# EAGLE design zero_board (EAGLE 9.6.2)
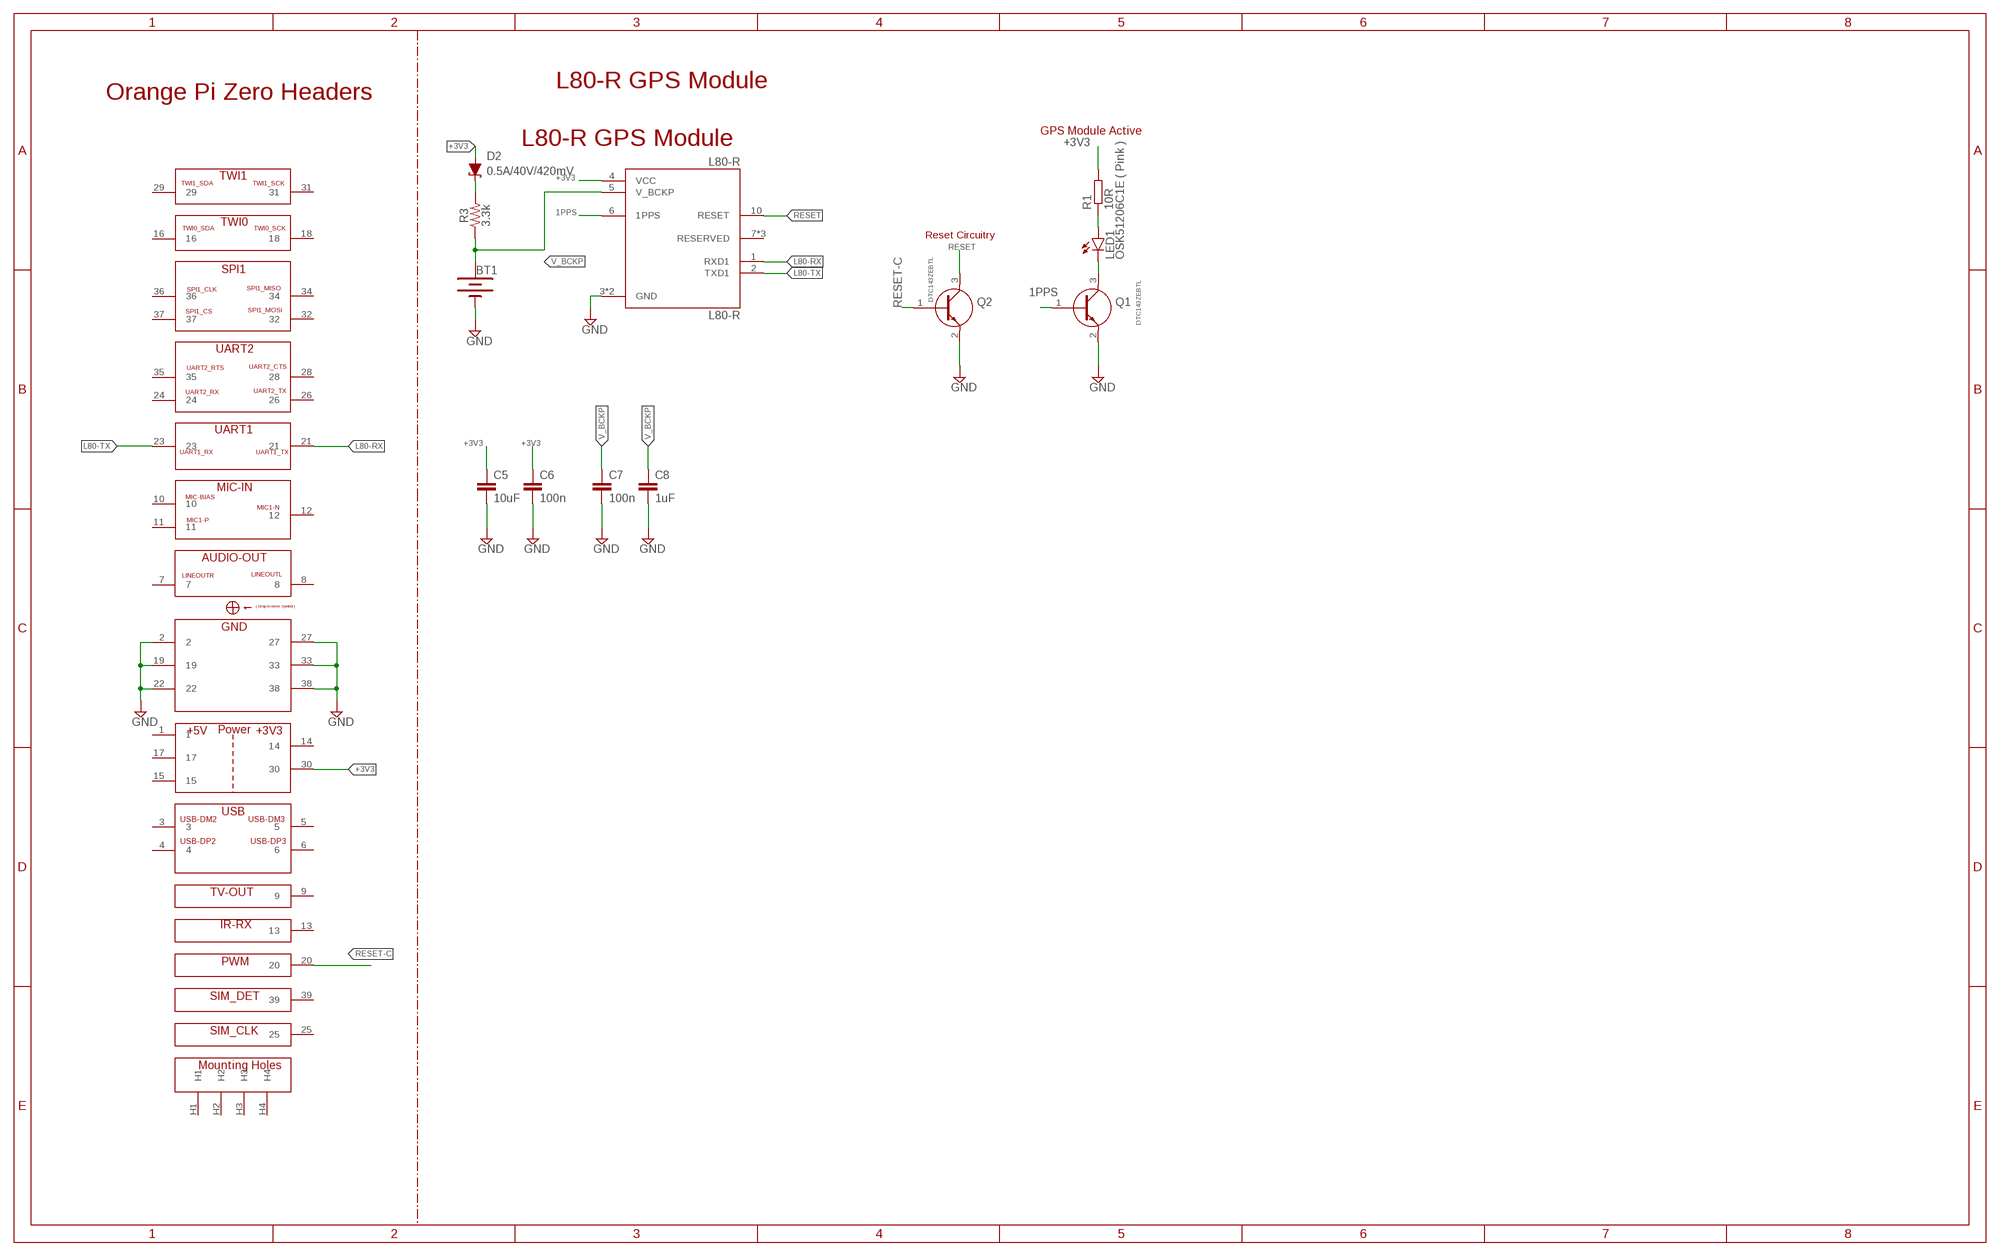
[diagram p0: schematic, sheet 1]

## Parts
BT1  6.8MM_COIN_CELL  ML414H_IV01E_BATTERY  [ML414H_IV01E]
C5  10uF  C-EUC0603  [C0603]
C6  100n  C-EUC0603  [C0603]
C7  100n  C-EUC0603  [C0603]
C8  1uF  C-EUC0603  [C0603]
D2  0.5A/40V/420mV  DIODE-SCHOTTKY-PMEG4005EJ  [SOD-323]
L80-R  L80-R  [XCVR_L80-R]
LED1  OSK51206C1E ( Pink )  LEDCHIPLED_1206  [CHIPLED_1206]
Q1  DTC143ZEBTL  [SOTFL50P160X85-3N]
Q2  DTC143ZEBTL  [SOTFL50P160X85-3N]
R1  10R  R-EU_R1206  [R1206]
R3  3.3k  3.3KOHM-0603-1/10W-1%  [0603]
U$1  ORANGE-PI-ZERO-ADDON  [ORANGE-PI-ZERO-ADDON]

## Nets
1PPS: L80-R.6(1PPS) Q1.1(B)
+3V3: C5.1 C6.1 D2.A L80-R.4(VCC) R1.2 U$1.30
GND: BT1.- C5.2 C6.2 C7.2 C8.2 L80-R.3(GND) L80-R.12(GND) Q1.2(E) Q2.2(E) U$1.2 U$1.19 U$1.22 U$1.27 U$1.33 U$1.38
L80-RX: L80-R.1(RXD1) U$1.21
L80-TX: L80-R.2(TXD1) U$1.23
N$3: LED1.C Q1.3(C)
N$4: LED1.A R1.1
N$6: D2.C R3.2
RESET: L80-R.10(RESET) Q2.3(C)
RESET-C: Q2.1(B) U$1.20
V_BCKP: BT1.+ C7.1 C8.1 L80-R.5(V_BCKP) R3.1
Unconnected: L80-R.7(RESERVED) L80-R.8(RESERVED) L80-R.11(RESERVED) U$1.3 U$1.4 U$1.5 U$1.6 U$1.7 U$1.8 U$1.9 U$1.10 U$1.11 U$1.12 U$1.13 U$1.16 U$1.18 U$1.24 U$1.25 U$1.26 U$1.28 U$1.29 U$1.31 U$1.32 U$1.34 U$1.35 U$1.36 U$1.37 U$1.39 U$1.H1 U$1.H2 U$1.H3 U$1.H4

## Notes on the sheet
- L80-R GPS Module
- Orange Pi Zero Headers
- GPS Module Active
- L80-R GPS Module
- Reset Circuitry

## Power pins joined to a net without a drawn wire
1: U$1.1
14: U$1.14
15: U$1.15
17: U$1.17

## Library data of the parts
BT1 = SparkFun-Batteries:ML414H_IV01E_BATTERY: SEIKO ML414H-IV01E Reflowable Lithium Battery ML414H is a rechargeable, coin type battery with features such as Pb-free reflowable (Peak temperature: 260 C) and high temperature heat resistance. Battery Characteristics: 3.1V max voltage Voff is 2V 1mAH 3k series resistor with battery 72 hour charge time from 2.0-3.1V 2.3-2.8V initial charge; PROD_ID: BATT-14267
C5-C8 = rcl:C-EU: CAPACITOR, European symbol; SPICEPREFIX: C
D2 = SparkFun-DiscreteSemi:DIODE-SCHOTTKY: Schottky diode A Schottky diode is a semiconductor diode which has a low forward voltage drop and a very fast switching action.; PROD_ID: DIO-10955
L80-R = L80-R:L80-R; AVAILABILITY: Unavailable; DESCRIPTION: L80-R is an ultra compact GPS POT (Patch on Top) module with an embedded 15.0mm × 15.0mm × 4.0mm patch antenna; MF: Quectel; MP: L80-R; PACKAGE: None; PRICE: None
LED1 = led:LED: LED OSRAM: - CHIPLED LG R971, LG N971, LY N971, LG Q971, LY Q971, LO R971, LY R971 LH N974, LH R974 LS Q976, LO Q976, LY Q976 LO Q996 - Hyper CHIPLED LW Q18S LB Q993, LB Q99A, LB R99A - SideLED LS A670, LO A670, LY A670, LG A670, LP A670 LB A673, LV A673, LT A673, LW A673 LH A674 LY A675 LS A676, LA A676, LO A676, LY A676, LW A676 LS A679, LY A679, LG A679 - Hyper Micro SIDELED® LS Y876, LA Y876, LO Y876, LY Y876 LT Y87S - SmartLED LW L88C, LW L88S LB L89C, LB L89S, LG L890 LS L89K, LO L89K, LY L89K LS L896, LA L896, LO L896, LY L896 - TOPLED LS T670, LO T670, LY T670, LG T670, LP T670 LSG T670, LSP T670, LSY T670, LOP T670, LYG T670 LG T671, LOG T671, LSG T671 LB T673, LV T673, LT T673, LW T673 LH T674 LS T676, LA T676, LO T676, LY T676, LB T676, LH T676, LSB T676, LW T676 LB T67C, LV T67C, LT T67C, LS T67K, LO T67K, LY T67K, LW E67C LS E67B, LA E67B, LO E67B, LY E67B, LB E67C, LV E67C, LT E67C LW T67C LS T679, LY T679, LG T679 LS T770, LO T770, LY T770, LG T770, LP T770 LB T773, LV T773, LT T773, LW T773 LH T774 LS E675, LA E675, LY E675, LS T675 LS T776, LA T776, LO T776, LY T776, LB T776 LHGB T686 LT T68C, LB T68C - Hyper Mini TOPLED® LB M676 - Mini TOPLED Santana® LG M470 LS M47K, LO M47K, LY M47K Source: http://www.osram.convergy.de LUXEON: - LUMILED® LXK2-PW12-R00, LXK2-PW12-S00, LXK2-PW14-U00, LXK2-PW14-V00 LXK2-PM12-R00, LXK2-PM12-S00, LXK2-PM14-U00 LXK2-PE12-Q00, LXK2-PE12-R00, LXK2-PE12-S00, LXK2-PE14-T00, LXK2-PE14-U00 LXK2-PB12-K00, LXK2-PB12-L00, LXK2-PB12-M00, LXK2-PB14-N00, LXK2-PB14-P00, LXK2-PB14-Q00 LXK2-PR12-L00, LXK2-PR12-M00, LXK2-PR14-Q00, LXK2-PR14-R00 LXK2-PD12-Q00, LXK2-PD12-R00, LXK2-PD12-S00 LXK2-PH12-R00, LXK2-PH12-S00 LXK2-PL12-P00, LXK2-PL12-Q00, LXK2-PL12-R00 Source: www.luxeon.com KINGBRIGHT: KA-3528ASYC Source: www.kingbright.com
Q1 Q2 = SamacSys_Parts:DTC143ZEBTL: ROHM, DTC143ZEBTL NPN Digital Transistor, 100 mA 50 V 4.7 k, Ratio Of 10, 3-Pin SC-89 Source: Datasheet <https://www.rohm.com/datasheet/DTC143ZEB/dtc143zebtl-e>; ARROW_PART_NUMBER: DTC143ZEBTL; ARROW_PRICE-STOCK: https://www.arrow.com/en/products/dtc143zebtl/rohm-semiconductor; DESCRIPTION: ROHM, DTC143ZEBTL NPN Digital Transistor, 100 mA 50 V 4.7 k, Ratio Of 10, 3-Pin SC-89; HEIGHT: 0.85mm; MANUFACTURER_NAME: ROHM Semiconductor; MANUFACTURER_PART_NUMBER: DTC143ZEBTL; MOUSER_PART_NUMBER: 755-DTC143ZEBTL; MOUSER_PRICE-STOCK: https://www.mouser.co.uk/ProductDetail/ROHM-Semiconductor/DTC143ZEBTL?qs=IsRgwgmxh6%252Bn%252Bp0edl8N%2Fw%3D%3D
R1 = rcl:R-EU_: RESISTOR, European symbol; SPICEPREFIX: R
R3 = SparkFun-Resistors:3.3KOHM: 3.3kΩ resistor A resistor is a passive two-terminal electrical component that implements electrical resistance as a circuit element. Resistors act to reduce current flow, and, at the same time, act to lower voltage levels within circuits. - Wikipedia; PROD_ID: RES-07851
U$1 = Orange-Pi-Zero-Addon-Board:ORANGE-PI-ZERO-ADDON

## Board
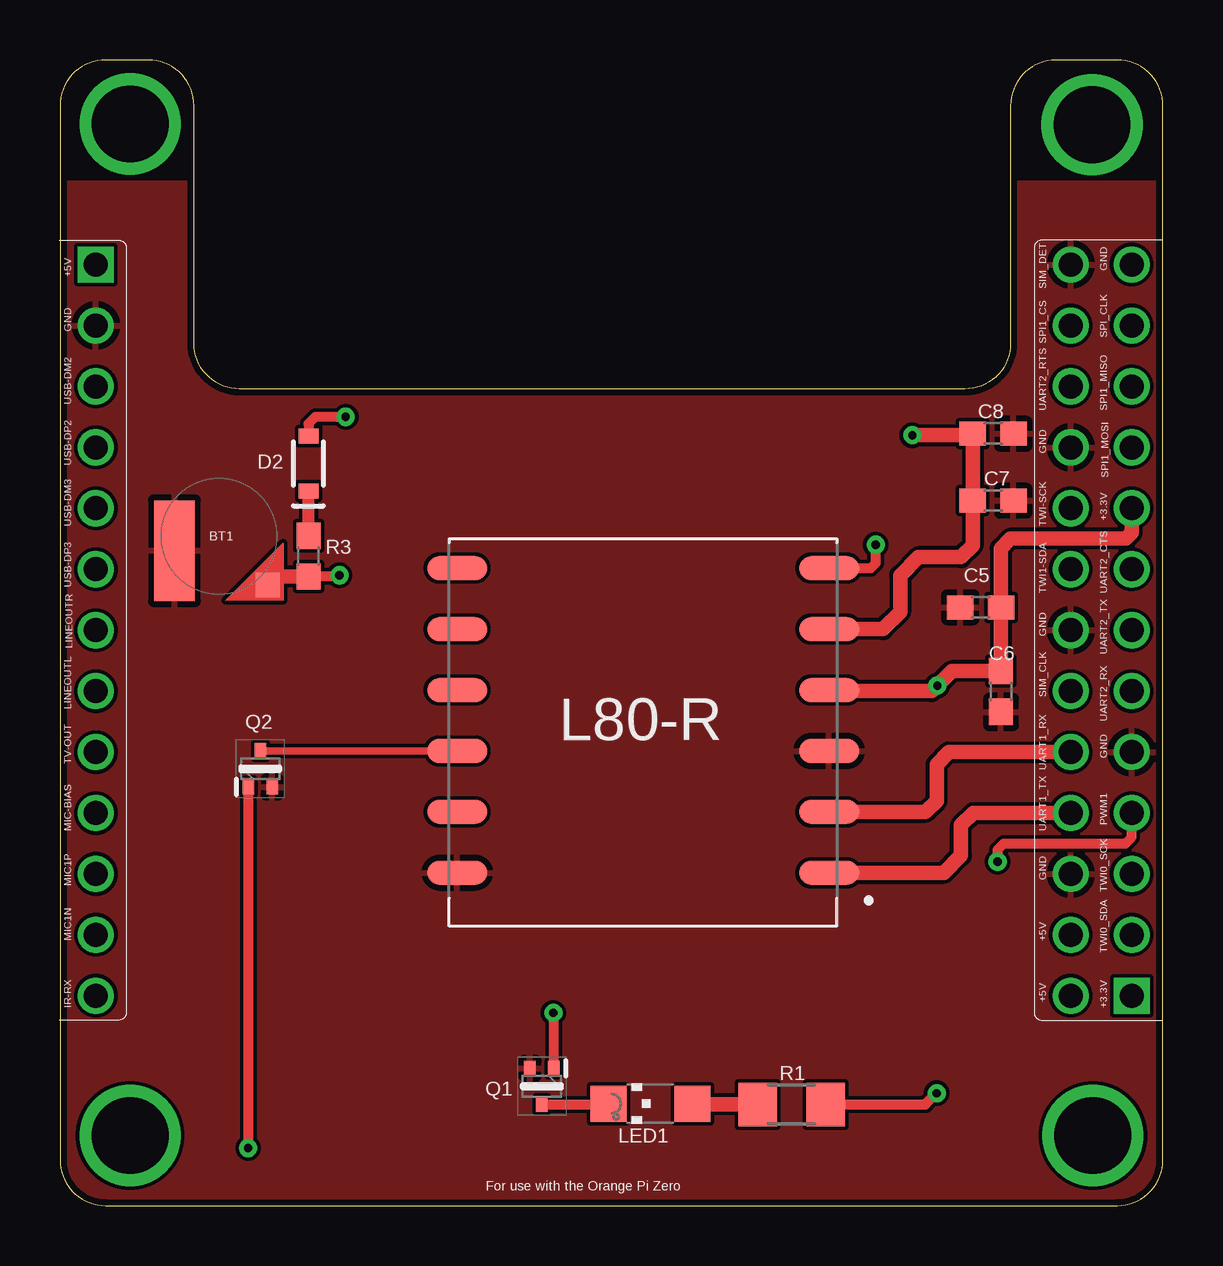
[diagram p1: board, top side]
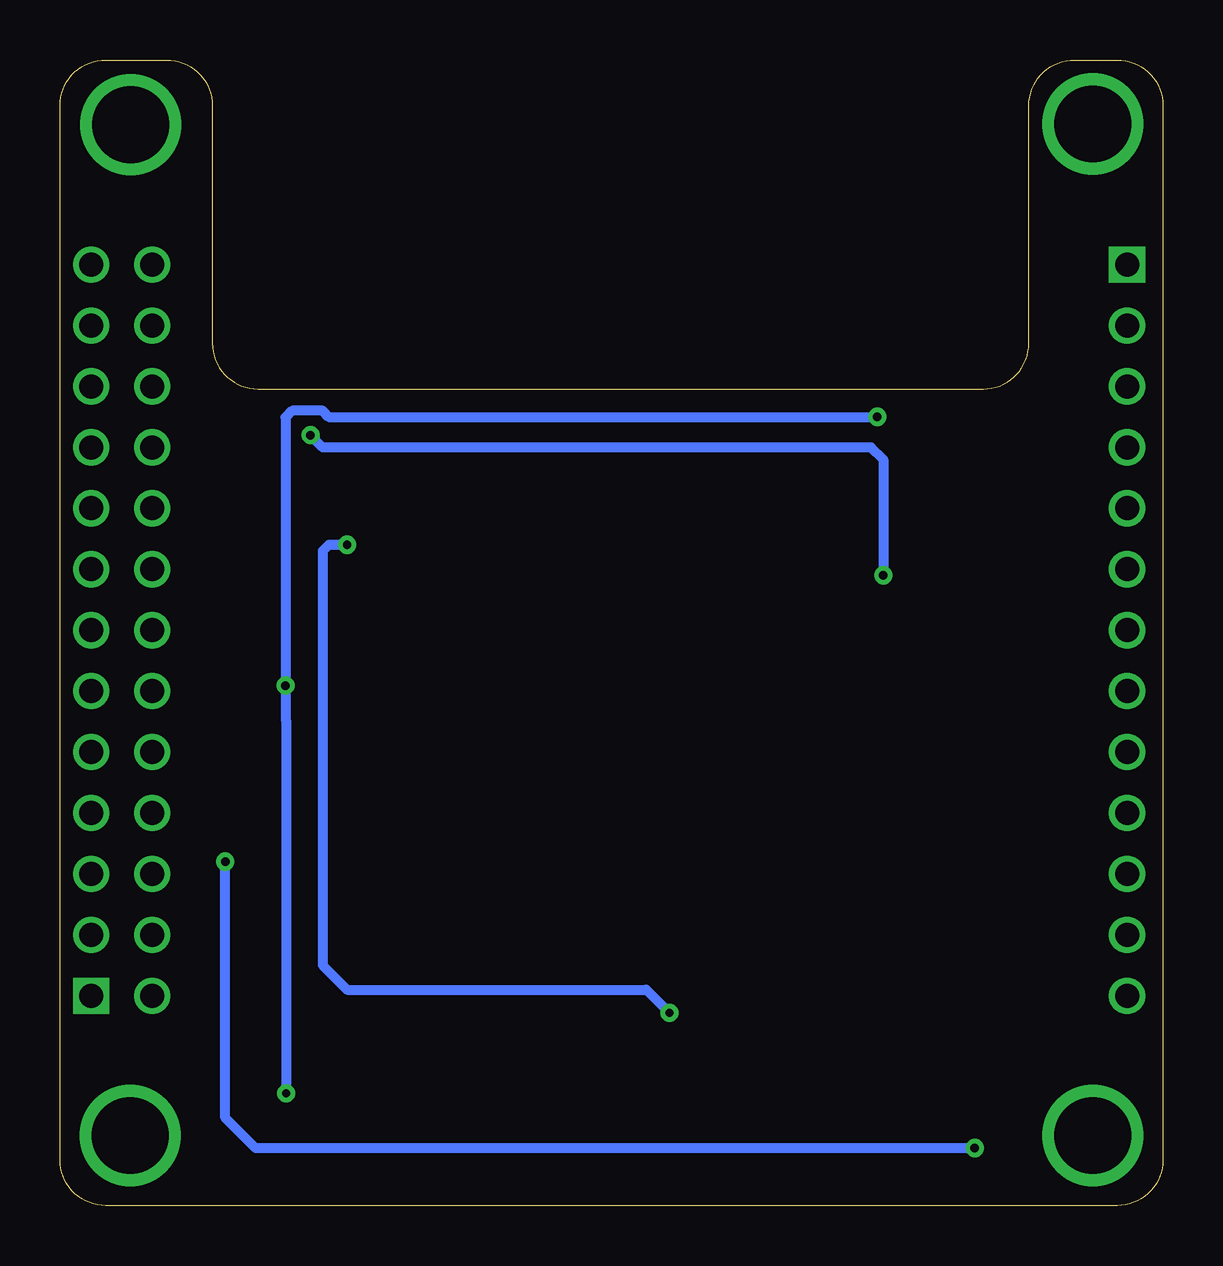
[diagram p2: board, bottom side, seen from below]

Size 45.97 x 47.75 mm. Coordinates in mm from the lower left corner, seen from the top.
Copper layers (1*16): Top 0.035mm / dielectric 1.5mm / Bottom 0.035mm
Design rules "default *": minimum track width 6mil, minimum drill 0.35mm, track to track 6mil, track to pad 6mil, pad to pad 6mil, via to via 6mil, smd to smd 6mil, copper to edge 10mil, drill to drill 6mil, minimum pad ring 10mil, minimum via ring 8mil, stop-mask expansion 4mil, vias tented up to drill 0mil, thermal gap 10mil
tRestrict: area -0.3,42.8 to 5.8,48.1; area 39.1,42.8 to 46.2,48.4

### Footprints (pad centres in the part's own frame; a part is rotated, then mirrored left to right if it is on the bottom)
ML414H_IV01E = smd 1 x 1: + 2.022,2.032 | smd 4.2 x 1.7: - 0.6,-1.85
C0603 = smd 1.1 x 1: 1 -0.85,0; 2 0.85,0
SOD-323 = smd 0.63 x 0.83: A 1.15,0; C -1.15,0
XCVR_L80-R = smd 2.5 x 1: 1 -7.75,6.35; 2 -7.75,3.81; 3 -7.75,1.27; 4 -7.75,-1.27; 5 -7.75,-3.81; 6 -7.75,-6.35; 7 7.75,-6.35; 8 7.75,-3.81; 9 7.75,-1.27; 10 7.75,1.27; 11 7.75,3.81; 12 7.75,6.35
CHIPLED_1206 = smd 1.5 x 1.5: A 0,-1.75; C 0,1.75
SOTFL50P160X85-3N = smd 0.64 x 0.48: 1 -0.75,0.5; 2 -0.75,-0.5; 3 0.75,0
R1206 = smd 1.6 x 1.803: 1 -1.422,0; 2 1.422,0
0603 = smd 1.1 x 1: 1 -0.85,0; 2 0.85,0
ORANGE-PI-ZERO-ADDON = drill 1 square: 1 7.62,40.64; 14 50.8,10.16 | drill 1: 2 7.62,38.1; 3 7.62,35.56; 4 7.62,33.02; 5 7.62,30.48; 6 7.62,27.94; 7 7.62,25.4; 8 7.62,22.86; 9 7.62,20.32; 10 7.62,17.78; 11 7.62,15.24; 12 7.62,12.7; 13 7.62,10.16; 15 48.26,10.16; 16 50.8,12.7; 17 48.26,12.7; 18 50.8,15.24; 19 48.26,15.24; 20 50.8,17.78; 21 48.26,17.78; 22 50.8,20.32; 23 48.26,20.32; 24 50.8,22.86; 25 48.26,22.86; 26 50.8,25.4; 27 48.26,25.4; 28 50.8,27.94; 29 48.26,27.94; 30 50.8,30.48; 31 48.26,30.48; 32 50.8,33.02; 33 48.26,33.02; 34 50.8,35.56; 35 48.26,35.56; 36 50.8,38.1; 37 48.26,38.1; 38 48.26,40.64; 39 50.8,40.64 | drill 3.2: H1 9.047,46.5; H2 49.15,46.465; H3 9.047,4.336; H4 49.179,4.336

### Placement (x,y rotation side)
BT1  6.62,27.9 270 top
C5  38.37,24.94 180 top
C6  39.23,21.43 270 top
C7  38.9,29.38 0 top
C8  38.9,32.18 0 top
D2  10.36,30.93 90 top
L80-R  24.3,20.22 180 top
LED1  24.61,4.25 90 top
Q1  20.09,4.97 270 top
Q2  8.35,18.21 90 top
R1  30.5,4.21 0 top
R3  10.36,27.07 90 top
U$1  -6.13,-1.41 0 top

### Tracks (layer width: path | path; a pad name or v marks a point on that pad's centre or on a via)
1PPS  (via drill 0.35)
  Top 0.406: L80-R.6 33.8,26.57 34.01,26.78 v34.01,27.54 | v20.57,8.03 20.57,5.74 Q1.1
  Bottom 0.406: v34.01,27.54 34.51,27.54 34.77,27.54 35.02,27.29 35.02,10.02 34.01,9 21.56,9 21.53,9 v20.57,8.03
+3V3  (via drill 0.35)
  Top 0.406: R1.2 36.08,4.21 v36.55,4.68 | D2.A 10.36,32.6 10.64,32.88 v11.91,32.88
  Top 0.61: U$1.30 44.67,28.05 44.42,27.79 39.62,27.79 39.21,27.39 39.21,24.95 C5.1 C6.1 37.18,22.28 v36.57,21.67 36.34,21.44 32.1,21.44 L80-R.4
  Bottom 0.406: v36.55,4.68 36.55,20.18 36.55,21.65 v36.57,21.67 36.57,32.85 36.29,33.13 35.02,33.13 34.77,32.88 v11.91,32.88
GND
  pour Top: -3.59,50.66 48.48,50.66 48.48,-3.96 -3.59,-3.96
L80-RX
  Top 0.61: L80-R.1 36.84,13.87 37.56,14.59 37.56,15.86 38.07,16.36 U$1.21
L80-TX
  Top 0.61: L80-R.2 36.08,16.41 36.55,16.87 36.55,18.4 37.05,18.9 U$1.23
N$3
  Top 0.406: Q1.3 22.83,4.22 LED1.C
N$4
  Top 0.61: R1.1 26.4,4.21 LED1.A
N$6
  Top 0.508: R3.2 D2.C
RESET
  Top 0.305: L80-R.10 9.21,18.95 Q2.3
RESET-C  (via drill 0.35)
  Top 0.406: Q2.1 v7.85,2.4 v7.84,2.39 | v39.09,14.33 39.09,14.84 39.34,15.1 44.42,15.1 44.67,15.35 U$1.20
  Bottom 0.406: v7.84,2.39 37.82,2.39 39.09,3.66 v39.09,14.33
V_BCKP  (via drill 0.35)
  Top 0.406: v11.65,26.27 11.6,26.22 R3.1
  Top 0.61: L80-R.5 34.3,24.03 35.02,24.75 35.02,26.27 35.78,27.03 37.56,27.03 38.05,27.52 C7.1 C8.1 37.98,32.11 v35.53,32.11 | R3.1 9,26.22 BT1.+
  Bottom 0.406: v35.53,32.11 35.02,31.61 12.16,31.61 11.65,31.1 v11.65,26.27